# Altium schematic sheet Gastroscopy-Tool-Input.SchDoc: Input
size 279 x 215 mm; Date: not used; ApprovedBy: not used; CheckedBy: not used; Author: not used; DrawnBy: not used; Organization: not used; SheetNumber: 1; SheetTotal: 1; Time: not used; ImagePath: not used; Application_BuildNumber: not used
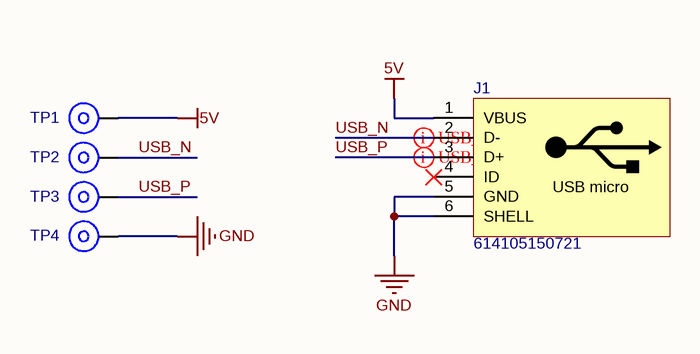
[diagram p0: Gastroscopy-Tool-Input.SchDoc]

## Parts
J1  614105150721  [614105150721]
TP1  TEST_POINT_TH  [TEST_POINT_TH]  (value not drawn)  (no BOM)
TP2  TEST_POINT_TH  [TEST_POINT_TH]  (value not drawn)  (no BOM)
TP3  TEST_POINT_TH  [TEST_POINT_TH]  (value not drawn)  (no BOM)
TP4  TEST_POINT_TH  [TEST_POINT_TH]  (value not drawn)  (no BOM)

## Nets
5V: J1.1(VBUS) TP1.1
GND: J1.5(GND) J1.6(SHELL) TP4.1
USB_N: J1.2(D-) TP2.1
USB_P: J1.3(D+) TP3.1

Not connected (* = marked no-connect by the designer): J1 4(ID)*

## Layout directives
differential pair; differential pair class USB_DIFFPAIR: USB_N, USB_P

## Notes on the sheet
- Title:
- Date:
- Size A
- Project:
- Number:
- Time:
- Sheet
- Revision
- of
- Engineer:
- www.mrobots.ru <http://mrobots.ru/>
- File:
- (in symbol 614105150721) USB micro

## Library data of the parts
J1 = 614105150721: CONN RCPT USB2.0 MICRO B VERT; Manufacturer 1: Wurth Electronics; Connector Type: USB; Number of Contacts: 5; Gender: Receptacle; Supplier 1: RSComponents; Manufacturer Part Number 1: 614105150721; RoHS: Yes; Category: USB Connectors; Stock 1: 1957; Pricing 1: 10=1,69000, 50=1,53000, 100=1,45000, 250=1,41000 (GBP); Mount: Through Hole,Vertical; Contact Material: Copper Alloy; Contact Plating: Gold; Packaging: Tape and Reel; Orientation: Vertical; USB Standard: USB 2.0; Features: Shielded; Reach SVHC Compliant: Unknown; Lead Free: Lead Free; RoHS Compliant: Yes; ComponentLink1URL: https://www.distrelec.biz/Web/Downloads/40/30/614105150721.pdf?mime=application%2Fpdf&src-supplier=Distrelec; ComponentLink1Description: https://www.distrelec.biz/Web/Downloads/40/30/614105150721.pdf?mime=application%2Fpdf&src-supplier=Distrelec; ComponentLink2URL: http://www.farnell.com/cad/2130953.pdf?src-supplier=Element14; ComponentLink2Description: http://www.farnell.com/cad/2130953.pdf?src-supplier=Element14; ComponentLink3URL: https://katalog.we-online.de/em/datasheet/614105150721.pdf?src-supplier=Digi-Key; ComponentLink3Description: https://katalog.we-online.de/em/datasheet/614105150721.pdf?src-supplier=Digi-Key; Supplier Part Number 1: 1225097P
TP1-TP4 = TEST_POINT_TH: TH TETS POINT